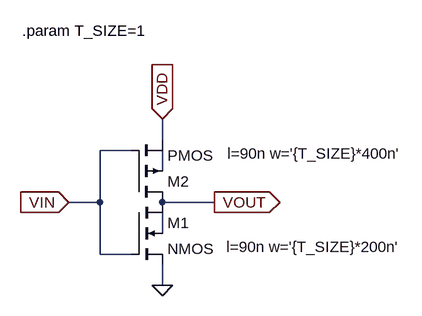
[diagram p0: schematic inverter.asc]
inverter.asc, the LTspice schematic file:
Version 4
SHEET 1 880 680
WIRE 160 80 160 48
WIRE 112 96 64 96
WIRE 160 128 160 96
WIRE 64 176 64 96
WIRE 64 176 16 176
WIRE 240 176 160 176
WIRE 160 224 160 192
WIRE 64 256 64 176
WIRE 112 256 64 256
WIRE 160 304 160 272
FLAG 16 176 VIN
IOPIN 16 176 In
FLAG 160 48 VDD
IOPIN 160 48 In
FLAG 240 176 VOUT
IOPIN 240 176 Out
FLAG 160 304 0
SYMBOL nmos4 112 176 R0
WINDOW 123 147 69 Left 2
SYMATTR Value2 l=90n w='{T_SIZE}*200n'
SYMATTR InstName M1
SYMBOL pmos4 112 176 M180
WINDOW 123 148 75 Left 2
SYMATTR Value2 l=90n w='{T_SIZE}*400n'
SYMATTR InstName M2
TEXT -56 -88 Left 2 !.param T_SIZE=1

The netlist it stands for:
* inverter.asc
M1 VOUT VIN 0 N002 NMOS l=90n w='{T_SIZE}*200n'
M2 VOUT VIN VDD N001 PMOS l=90n w='{T_SIZE}*400n'
.model NMOS NMOS
.model PMOS PMOS
.lib standard.mos
.param T_SIZE=1
.backanno
.end